# EAGLE design Main (EAGLE 7.2.0)
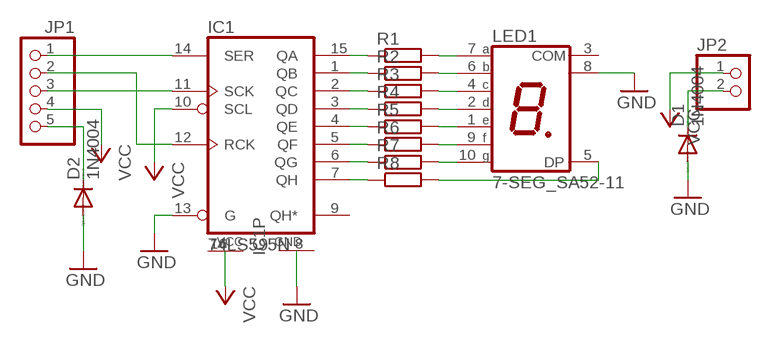
[diagram p0: schematic, sheet 1]

## Parts
D1  1N4004  [DO41-10]
D2  1N4004  [DO41-10]
IC1  74LS595N  [DIL16]
JP1  PINHD-1X5  [1X05]
JP2  PINHD-1X2/90  [1X02/90]
LED1  7-SEG_SA52-11  [SA52-11]
R1  R-EU_0309/12  [0309/12]
R2  R-EU_0309/12  [0309/12]
R3  R-EU_0309/12  [0309/12]
R4  R-EU_0309/12  [0309/12]
R5  R-EU_0309/12  [0309/12]
R6  R-EU_0309/12  [0309/12]
R7  R-EU_0309/12  [0309/12]
R8  R-EU_0309/12  [0309/12]

## Nets
GND: D1.A D2.A IC1.13(G) LED1.8(COM)
N$1: LED1.7(A) R1.2
N$2: LED1.6(B) R2.2
N$3: LED1.4(C) R3.2
N$4: LED1.2(D) R4.2
N$5: LED1.1(E) R5.2
N$6: LED1.9(F) R6.2
N$7: LED1.10(G) R7.2
N$8: LED1.5(DP) R8.2
N$9: IC1.15(QA) R1.1
N$10: IC1.1(QB) R2.1
N$11: IC1.2(QC) R3.1
N$12: IC1.3(QD) R4.1
N$13: IC1.4(QE) R5.1
N$14: IC1.5(QF) R6.1
N$15: IC1.6(QG) R7.1
N$16: IC1.7(QH) R8.1
N$17: IC1.14(SER) JP1.1
N$18: IC1.12(RCK) JP1.2
N$19: IC1.11(SCK) JP1.3
N$22: D1.C JP2.2
N$23: D2.C JP1.5
VCC: IC1.10(SCL) JP1.4 JP2.1
Unconnected: IC1.9(QH*) LED1.3(COM)

## Power pins joined to a net without a drawn wire
GND: IC1.8(GND)
VCC: IC1.16(VCC)

## Library data of the parts
D1 D2 = diode:1N4004: DIODE general purpose rectifier, 1 A
IC1 = 74xx-eu:74*595: 8-bit SHIFT REGISTER, output latch
JP1 = pinhead:PINHD-1X5: PIN HEADER
JP2 = pinhead:PINHD-1X2: PIN HEADER
LED1 = display-kingbright:7-SEG_: Kingbright 14.2mm (0.56 INCH) SINGLE DIGIT NUMERIC DUISPLAY Source: SA56-11EWA(Ver1189471036.pdf; OC_FARNELL: unknown; OC_NEWARK: unknown
R1-R8 = resistor:R-EU_: RESISTOR, European symbol

## Board
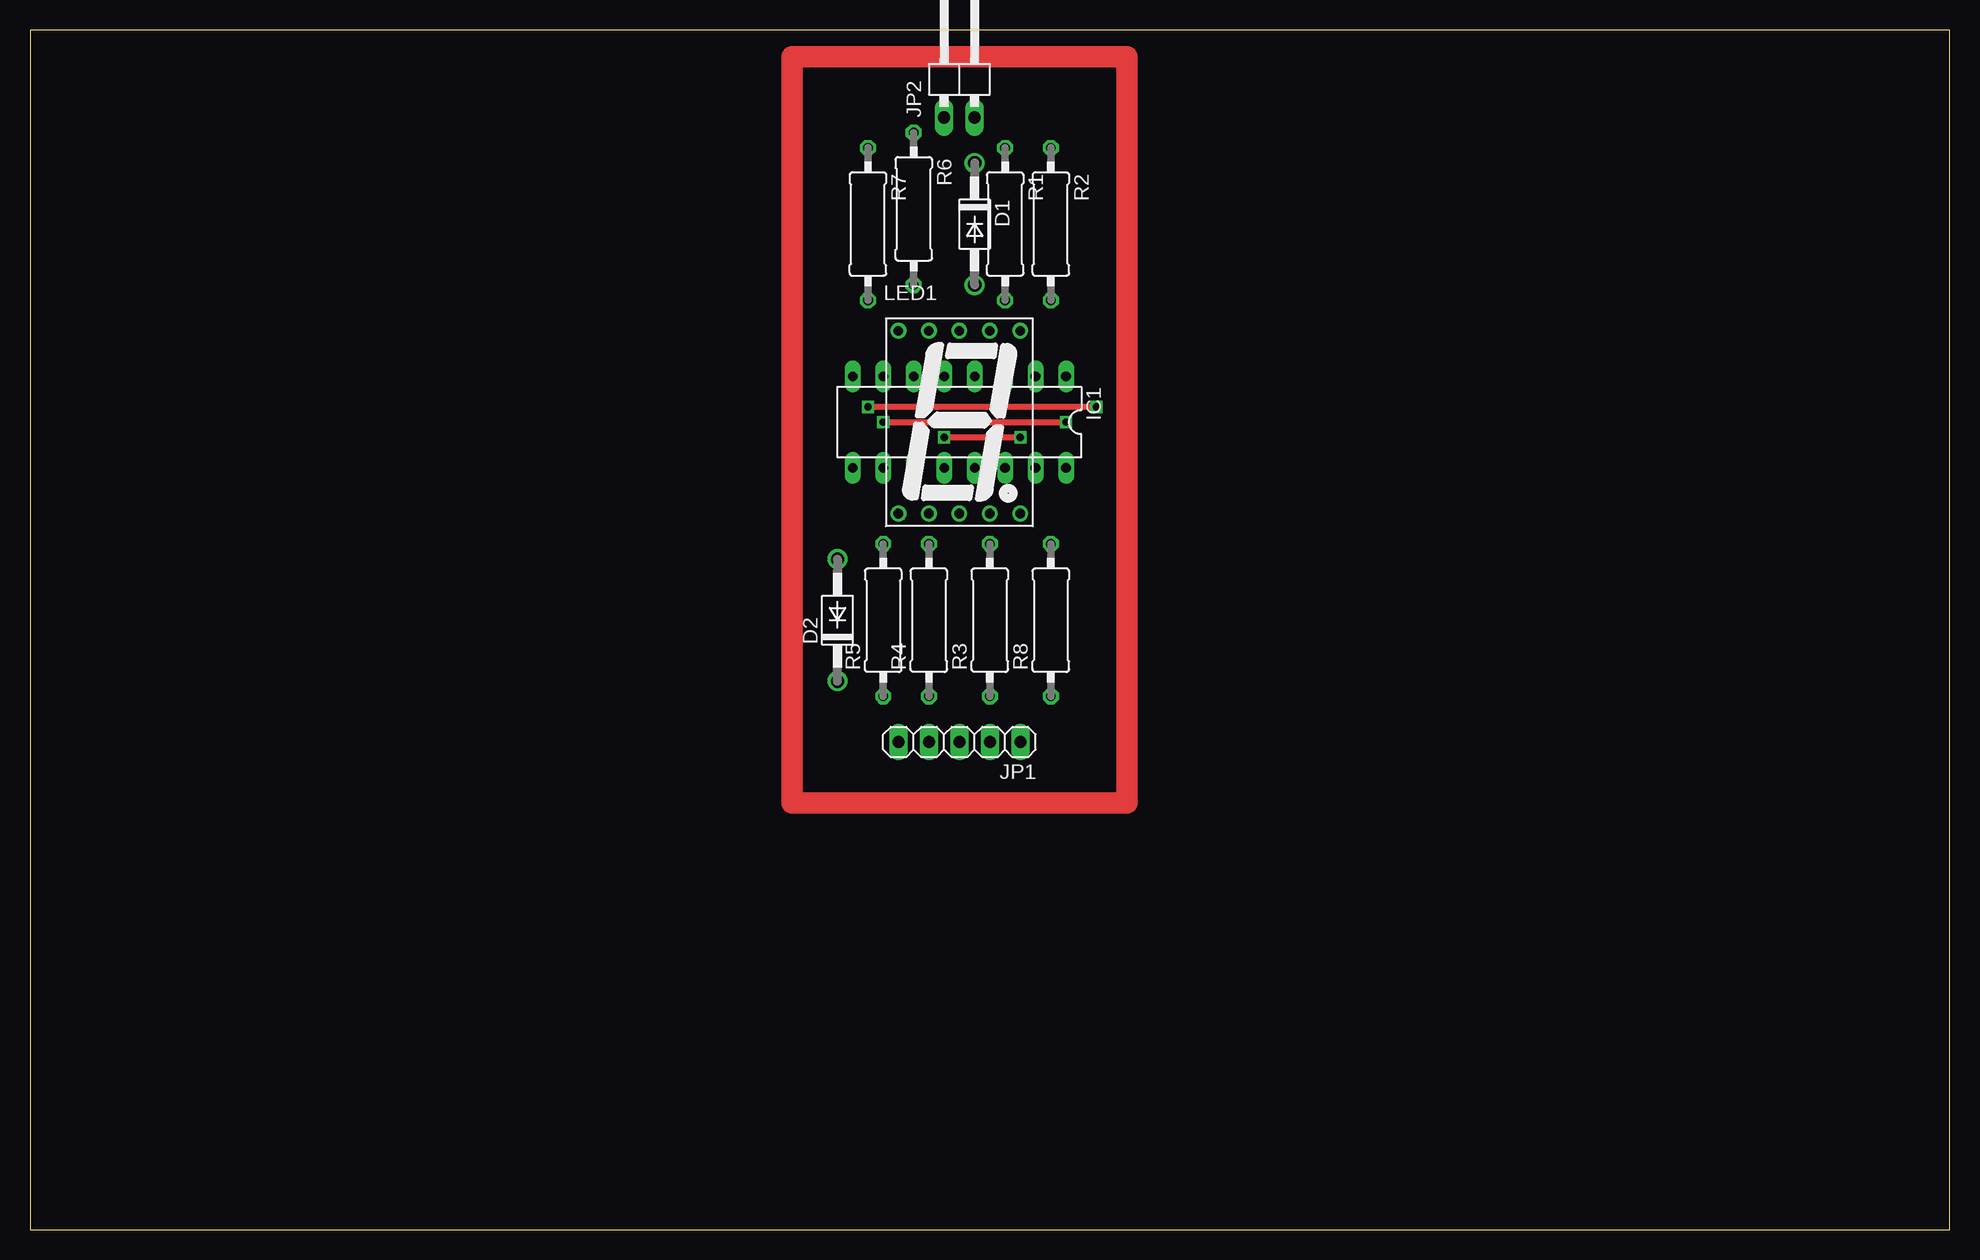
[diagram p1: board, top side]
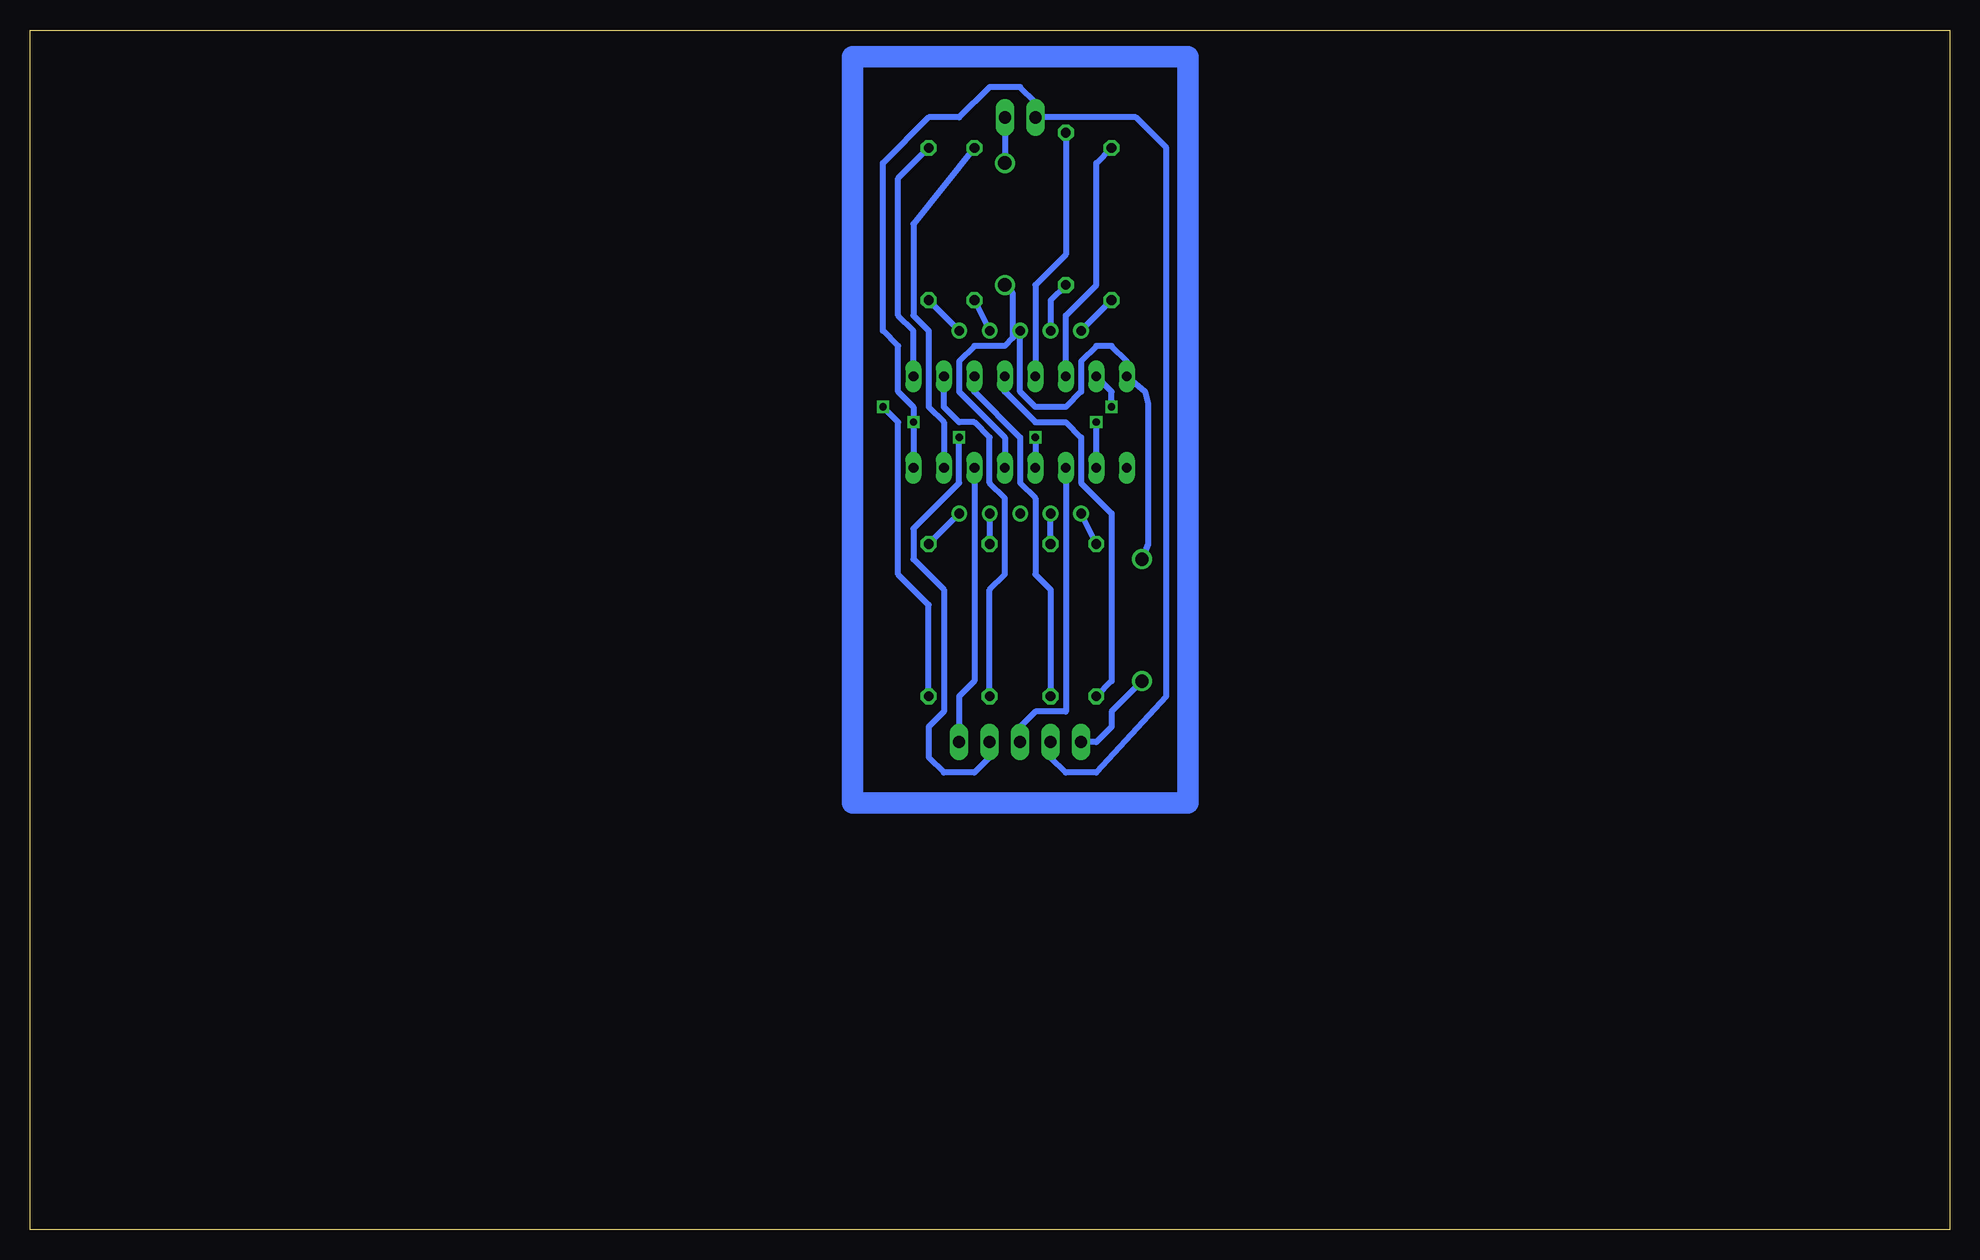
[diagram p2: board, bottom side, seen from below]

Size 160 x 100 mm. Coordinates in mm from the lower left corner, seen from the top.
Outline: 0,0 160,0 160,100 0,100 0,0
Copper layers (1*16): Top 0.035mm / dielectric 1.5mm / Bottom 0.035mm
Design rules "default *": minimum track width 20mil, minimum drill 24mil, track to track 8mil, track to pad 8mil, pad to pad 8mil, via to via 8mil, smd to smd 8mil, copper to edge 40mil, drill to drill 8mil, minimum pad ring 10mil, minimum via ring 8mil, stop-mask expansion 4mil, vias tented up to drill 0mil, thermal gap 10mil

### Footprints (pad centres in the part's own frame; a part is rotated, then mirrored left to right if it is on the bottom)
DO41-10 = drill 1.118: A 5.08,0; C -5.08,0
DIL16 = drill 0.813 long: 1 -8.89,-3.81; 2 -6.35,-3.81; 3 -3.81,-3.81; 4 -1.27,-3.81; 5 1.27,-3.81; 6 3.81,-3.81; 7 6.35,-3.81; 8 8.89,-3.81; 9 8.89,3.81; 10 6.35,3.81; 11 3.81,3.81; 12 1.27,3.81; 13 -1.27,3.81; 14 -3.81,3.81; 15 -6.35,3.81; 16 -8.89,3.81
1X05 = drill 1.016 long: 1 -5.08,0; 2 -2.54,0; 3 0,0; 4 2.54,0; 5 5.08,0
1X02/90 = drill 1.016 long: 1 -1.27,-3.81; 2 1.27,-3.81
SA52-11 = drill 0.8: 1 -5.08,-7.62; 2 -2.54,-7.62; 3 0,-7.62; 4 2.54,-7.62; 5 5.08,-7.62; 6 5.08,7.62; 7 2.54,7.62; 8 0,7.62; 9 -2.54,7.62; 10 -5.08,7.62
0309/12 = drill 0.813 octagon: 1 -6.35,0; 2 6.35,0

### Placement (x,y rotation side)
D1  78.74,83.82 270 top
D2  67.31,50.8 90 top
IC1  77.47,67.31 180 top
JP1  77.47,40.64 180 top
JP2  77.47,96.52 0 top
LED1  77.47,67.31 0 top
R1  81.28,83.82 270 top
R2  85.09,83.82 270 top
R3  80.01,50.8 90 top
R4  74.93,50.8 90 top
R5  71.12,50.8 90 top
R6  73.66,85.09 270 top
R7  69.85,83.82 270 top
R8  85.09,50.8 90 top

### Tracks (layer width: path | path; a pad name or v marks a point on that pad's centre or on a via)
GND
  Bottom 0.508: 78.11,74.3 LED1.8 77.47,69.85 76.2,68.58 73.66,68.58 72.39,69.85 72.39,72.39 71.12,73.66 69.85,73.66 68.58,72.39 IC1.8 67.06,69.85 66.8,68.83 66.8,57.15 D2.A | 78.11,74.3 78.74,73.66 81.28,73.66 82.55,72.39 82.55,69.85 78.74,66.04 IC1.13 | D1.A 78.11,78.11 78.11,74.3
N$1
  Bottom 0.508: R1.2 LED1.7
N$2
  Bottom 0.508: LED1.6 R2.2
N$3
  Bottom 0.508: LED1.4 R3.2
N$4
  Bottom 0.508: R4.2 LED1.2
N$5
  Bottom 0.508: R5.2 LED1.1
N$6
  Bottom 0.508: R6.2 74.93,77.47 LED1.9
N$7
  Bottom 0.508: R7.2 LED1.10
N$8
  Bottom 0.508: LED1.5 R8.2
N$9
  Bottom 0.508: R1.1 86.36,83.82 86.36,76.2 85.09,74.93 85.09,68.58 83.82,67.31 IC1.15
N$10
  Bottom 0.508: IC1.1 86.36,74.93 87.63,76.2 87.63,87.63 R2.1
N$11
  Bottom 0.508: IC1.2 83.82,68.58 82.55,67.31 81.28,67.31 80.01,66.04 80.01,62.23 78.74,60.96 78.74,54.61 80.01,53.34 R3.1
N$12
  Bottom 0.508: IC1.3 81.28,69.85 77.47,66.04 77.47,62.23 76.2,60.96 76.2,54.61 74.93,53.34 R4.1
N$13
  Bottom 0.508: IC1.4 78.74,69.85 76.2,67.31 73.66,67.31 72.39,66.04 72.39,62.23 69.85,59.69 69.85,45.72 R5.1
N$14
  Bottom 0.508: R6.1 73.66,81.28 76.2,78.74 IC1.5
N$15
  Bottom 0.508: IC1.6 73.66,76.2 71.12,78.74 71.12,88.9 R7.1
N$16  (via drill 0.61)
  Top 0.508: v88.9,68.58 v69.85,68.58
  Bottom 0.508: R8.1 85.09,52.07 87.63,54.61 87.63,67.31 v88.9,68.58 | v69.85,68.58 69.85,69.85 IC1.7
N$17
  Bottom 0.508: IC1.14 81.28,45.72 82.55,44.45 JP1.1
N$18  (via drill 0.61)
  Top 0.508: v82.55,66.04 v76.2,66.04
  Bottom 0.508: JP1.2 80.01,39.37 81.28,38.1 83.82,38.1 85.09,39.37 85.09,41.91 83.82,43.18 83.82,53.34 86.36,55.88 86.36,58.42 82.55,62.23 v82.55,66.04 | v76.2,66.04 IC1.12
N$19
  Bottom 0.508: IC1.11 73.66,43.18 76.2,43.18 77.47,41.91 JP1.3
N$20
  Bottom 1.778: 63.5,80.01 63.5,78.74 63.5,35.56 91.44,35.56 91.44,97.79 63.5,97.79 63.5,80.01
N$21
  Top 1.778: 63.5,78.74 63.5,76.2 63.5,35.56 91.44,35.56 91.44,97.79 63.5,97.79 63.5,78.74
N$22
  Bottom 0.508: JP2.2 D1.C
N$23
  Bottom 0.508: D2.C 69.85,43.18 69.85,41.91 71.12,40.64 JP1.5
VCC  (via drill 0.6, 0.61)
  Top 0.508: v71.12,67.31 v86.36,67.31
  Bottom 0.508: IC1.10 v71.12,67.31 | JP1.4 74.93,39.37 73.66,38.1 71.12,38.1 65.28,44.45 65.28,90.17 67.82,92.71 JP2.1 76.2,93.98 77.47,95.25 80.01,95.25 82.55,92.71 85.09,92.71 88.9,88.9 88.9,74.93 87.63,73.66 87.63,69.85 86.36,68.58 v86.36,67.31 IC1.16